# EAGLE design pc (EAGLE 9.6.2)
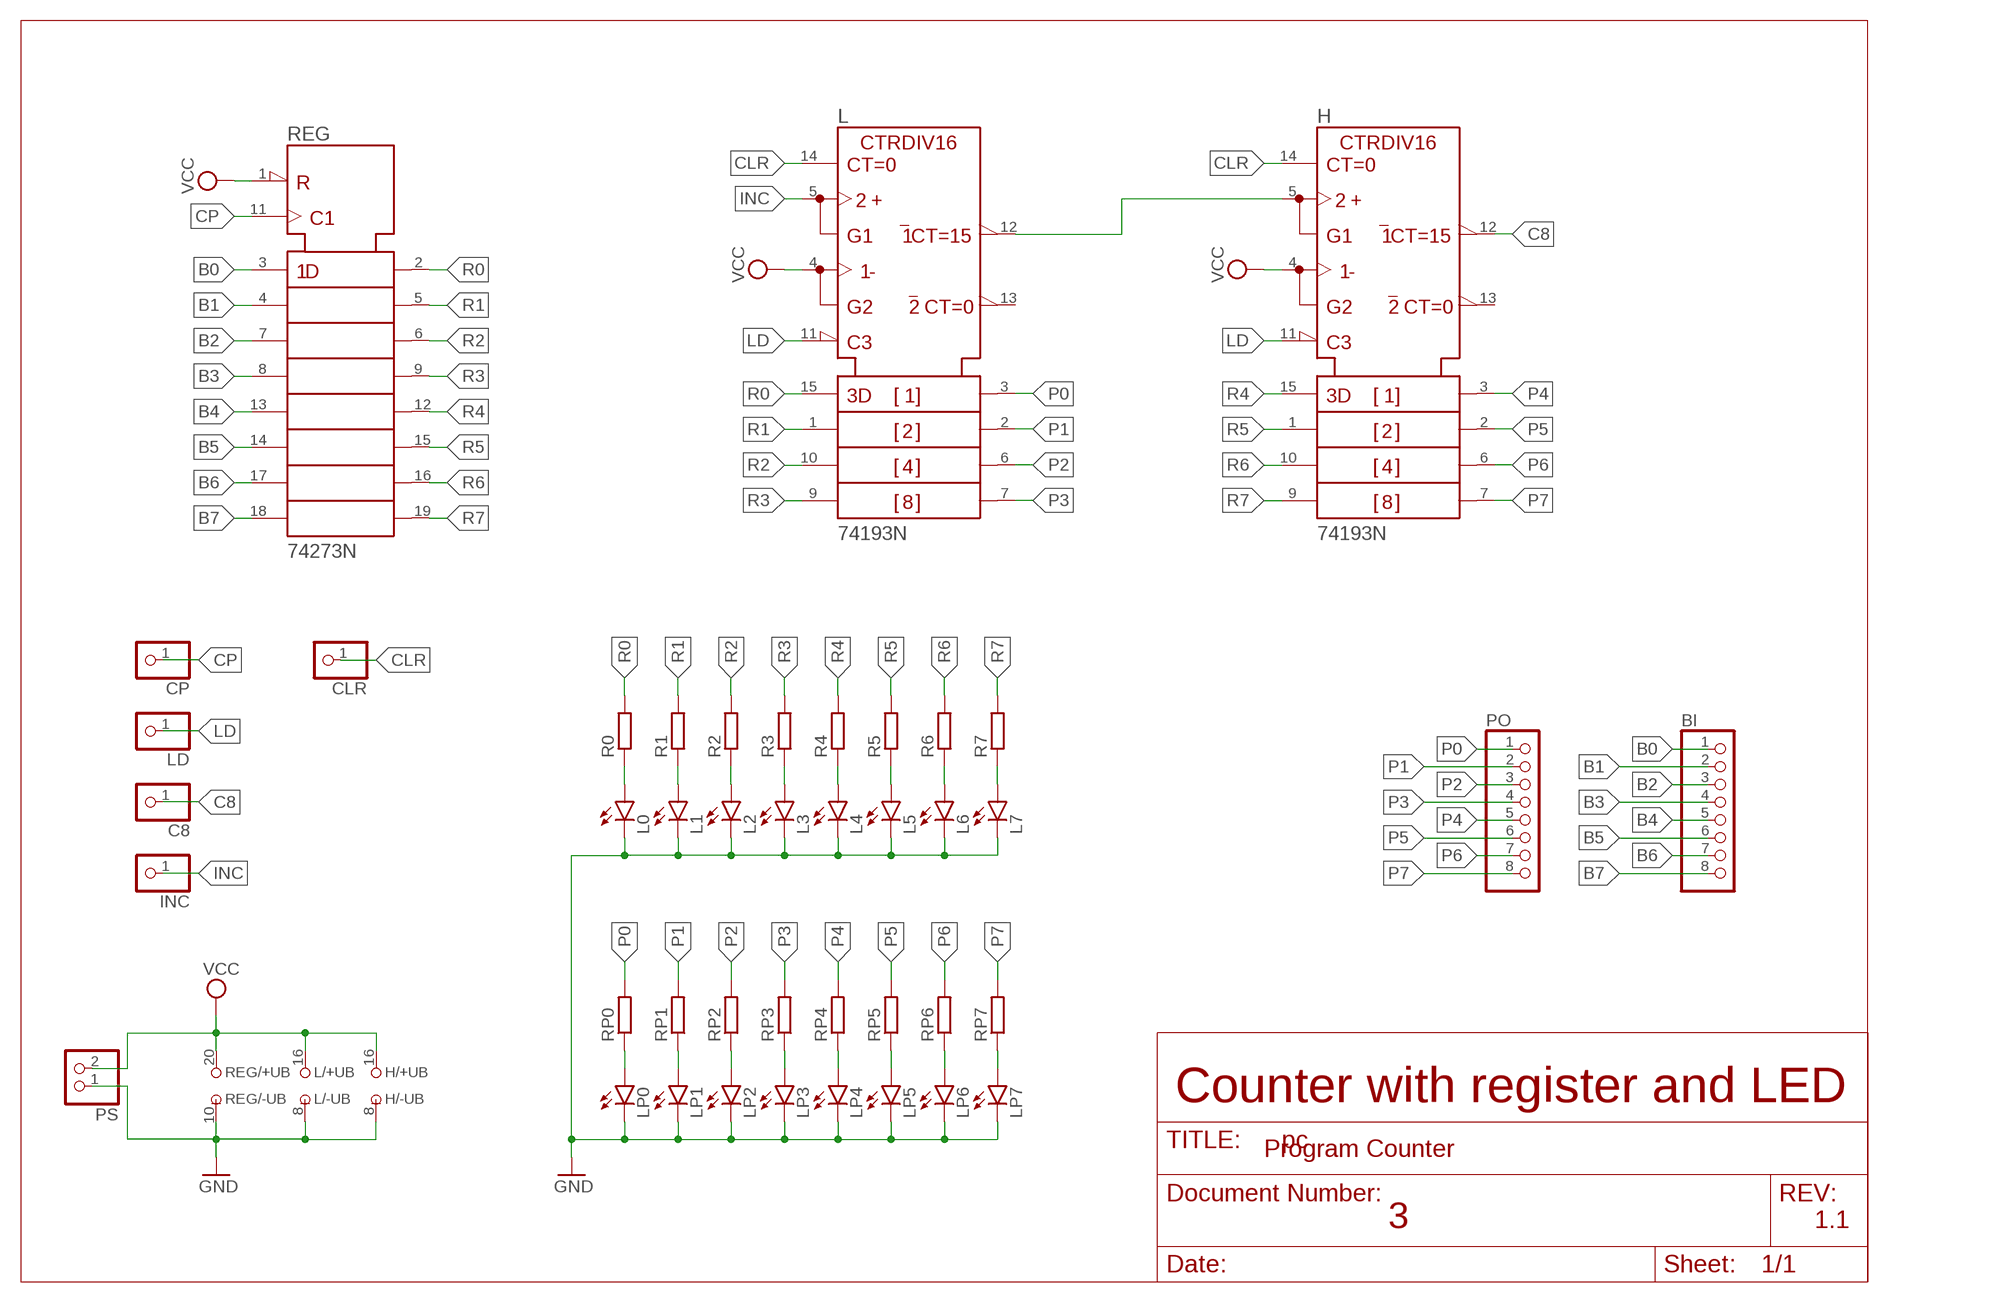
[diagram p0: schematic, sheet 1]

## Parts
BI  PINHD-1X8  [1X08]
C8  PINHD-1X1  [1X01]
CLR  PINHD-1X1  [1X01]
CP  PINHD-1X1  [1X01]
H  74193N  [DIL16]
INC  PINHD-1X1  [1X01]
L  74193N  [DIL16]
L0  LED5MM  [LED5MM]
L1  LED5MM  [LED5MM]
L2  LED5MM  [LED5MM]
L3  LED5MM  [LED5MM]
L4  LED5MM  [LED5MM]
L5  LED5MM  [LED5MM]
L6  LED5MM  [LED5MM]
L7  LED5MM  [LED5MM]
LD  PINHD-1X1  [1X01]
LP0  LED5MM  [LED5MM]
LP1  LED5MM  [LED5MM]
LP2  LED5MM  [LED5MM]
LP3  LED5MM  [LED5MM]
LP4  LED5MM  [LED5MM]
LP5  LED5MM  [LED5MM]
LP6  LED5MM  [LED5MM]
LP7  LED5MM  [LED5MM]
PO  PINHD-1X8  [1X08]
PS  PINHD-1X2  [1X02]
R0  R-EU_0204/7  [0204/7]
R1  R-EU_0204/7  [0204/7]
R2  R-EU_0204/7  [0204/7]
R3  R-EU_0204/7  [0204/7]
R4  R-EU_0204/7  [0204/7]
R5  R-EU_0204/7  [0204/7]
R6  R-EU_0204/7  [0204/7]
R7  R-EU_0204/7  [0204/7]
REG  74273N  [DIL20]
RP0  R-EU_0204/7  [0204/7]
RP1  R-EU_0204/7  [0204/7]
RP2  R-EU_0204/7  [0204/7]
RP3  R-EU_0204/7  [0204/7]
RP4  R-EU_0204/7  [0204/7]
RP5  R-EU_0204/7  [0204/7]
RP6  R-EU_0204/7  [0204/7]
RP7  R-EU_0204/7  [0204/7]

## Nets
B0: BI.1 REG.3(1D)
B1: BI.2 REG.4(2D)
B2: BI.3 REG.7(3D)
B3: BI.4 REG.8(4D)
B4: BI.5 REG.13(5D)
B5: BI.6 REG.14(6D)
B6: BI.7 REG.17(7D)
B7: BI.8 REG.18(8D)
C8: C8.1 H.12(!CO)
CLR: CLR.1 H.14(CLR) L.14(CLR)
CP: CP.1 REG.11(CLK)
GND: H.8(-UB) L0.K(C) L1.K(C) L2.K(C) L3.K(C) L4.K(C) L5.K(C) L6.K(C) L7.K(C) L.8(-UB) LP0.K(C) LP1.K(C) LP2.K(C) LP3.K(C) LP4.K(C) LP5.K(C) LP6.K(C) LP7.K(C) PS.1 REG.10(-UB)
INC: INC.1 L.5(UP)
LD: H.11(!LOAD) L.11(!LOAD) LD.1
N$17: L0.A R0.1
N$20: L1.A R1.1
N$21: H.5(UP) L.12(!CO)
N$24: L2.A R2.1
N$27: L3.A R3.1
N$45: LP0.A RP0.1
N$48: LP1.A RP1.1
N$51: LP2.A RP2.1
N$54: LP3.A RP3.1
N$57: LP4.A RP4.1
N$60: LP5.A RP5.1
N$63: LP6.A RP6.1
N$66: LP7.A RP7.1
N$70: L4.A R4.1
N$73: L5.A R5.1
N$76: L6.A R6.1
N$79: L7.A R7.1
P0: L.3(QA) PO.1 RP0.2
P1: L.2(QB) PO.2 RP1.2
P2: L.6(QC) PO.3 RP2.2
P3: L.7(QD) PO.4 RP3.2
P4: H.3(QA) PO.5 RP4.2
P5: H.2(QB) PO.6 RP5.2
P6: H.6(QC) PO.7 RP6.2
P7: H.7(QD) PO.8 RP7.2
R0: L.15(A) R0.2 REG.2(1Q)
R1: L.1(B) R1.2 REG.5(2Q)
R2: L.10(C) R2.2 REG.6(3Q)
R3: L.9(D) R3.2 REG.9(4Q)
R4: H.15(A) R4.2 REG.12(5Q)
R5: H.1(B) R5.2 REG.15(6Q)
R6: H.10(C) R6.2 REG.16(7Q)
R7: H.9(D) R7.2 REG.19(8Q)
VCC: H.4(DOWN) H.16(+UB) L.4(DOWN) L.16(+UB) PS.2 REG.1(!CLR) REG.20(+UB)
Unconnected: H.13(!BO) L.13(!BO)

## Notes on the sheet
- Counter with register and LED
- Program Counter
- 3 | 1.1

## Library data of the parts
BI PO = pinhead:PINHD-1X8: PIN HEADER
C8 CLR CP INC LD = pinhead:PINHD-1X1: PIN HEADER
H L = 74ttl-din:74*193: Synchronus 4-bit up down COUNTER
L0 L1-L7 LP0 LP1-LP7 = led:LED: LED OSRAM: - CHIPLED LG R971, LG N971, LY N971, LG Q971, LY Q971, LO R971, LY R971 LH N974, LH R974 LS Q976, LO Q976, LY Q976 LO Q996 - Hyper CHIPLED LW Q18S LB Q993, LB Q99A, LB R99A - SideLED LS A670, LO A670, LY A670, LG A670, LP A670 LB A673, LV A673, LT A673, LW A673 LH A674 LY A675 LS A676, LA A676, LO A676, LY A676, LW A676 LS A679, LY A679, LG A679 - Hyper Micro SIDELED® LS Y876, LA Y876, LO Y876, LY Y876 LT Y87S - SmartLED LW L88C, LW L88S LB L89C, LB L89S, LG L890 LS L89K, LO L89K, LY L89K LS L896, LA L896, LO L896, LY L896 - TOPLED LS T670, LO T670, LY T670, LG T670, LP T670 LSG T670, LSP T670, LSY T670, LOP T670, LYG T670 LG T671, LOG T671, LSG T671 LB T673, LV T673, LT T673, LW T673 LH T674 LS T676, LA T676, LO T676, LY T676, LB T676, LH T676, LSB T676, LW T676 LB T67C, LV T67C, LT T67C, LS T67K, LO T67K, LY T67K, LW E67C LS E67B, LA E67B, LO E67B, LY E67B, LB E67C, LV E67C, LT E67C LW T67C LS T679, LY T679, LG T679 LS T770, LO T770, LY T770, LG T770, LP T770 LB T773, LV T773, LT T773, LW T773 LH T774 LS E675, LA E675, LY E675, LS T675 LS T776, LA T776, LO T776, LY T776, LB T776 LHGB T686 LT T68C, LB T68C - Hyper Mini TOPLED® LB M676 - Mini TOPLED Santana® LG M470 LS M47K, LO M47K, LY M47K Source: http://www.osram.convergy.de LUXEON: - LUMILED® LXK2-PW12-R00, LXK2-PW12-S00, LXK2-PW14-U00, LXK2-PW14-V00 LXK2-PM12-R00, LXK2-PM12-S00, LXK2-PM14-U00 LXK2-PE12-Q00, LXK2-PE12-R00, LXK2-PE12-S00, LXK2-PE14-T00, LXK2-PE14-U00 LXK2-PB12-K00, LXK2-PB12-L00, LXK2-PB12-M00, LXK2-PB14-N00, LXK2-PB14-P00, LXK2-PB14-Q00 LXK2-PR12-L00, LXK2-PR12-M00, LXK2-PR14-Q00, LXK2-PR14-R00 LXK2-PD12-Q00, LXK2-PD12-R00, LXK2-PD12-S00 LXK2-PH12-R00, LXK2-PH12-S00 LXK2-PL12-P00, LXK2-PL12-Q00, LXK2-PL12-R00 Source: www.luxeon.com KINGBRIGHT: KA-3528ASYC Source: www.kingbright.com
PS = pinhead:PINHD-1X2: PIN HEADER
R0 R1-R7 RP0 RP1-RP7 = rcl:R-EU_: RESISTOR, European symbol; SPICEPREFIX: R
REG = 74ttl-din:74*273: Octal D type FLIP FLOP, clear

## Board
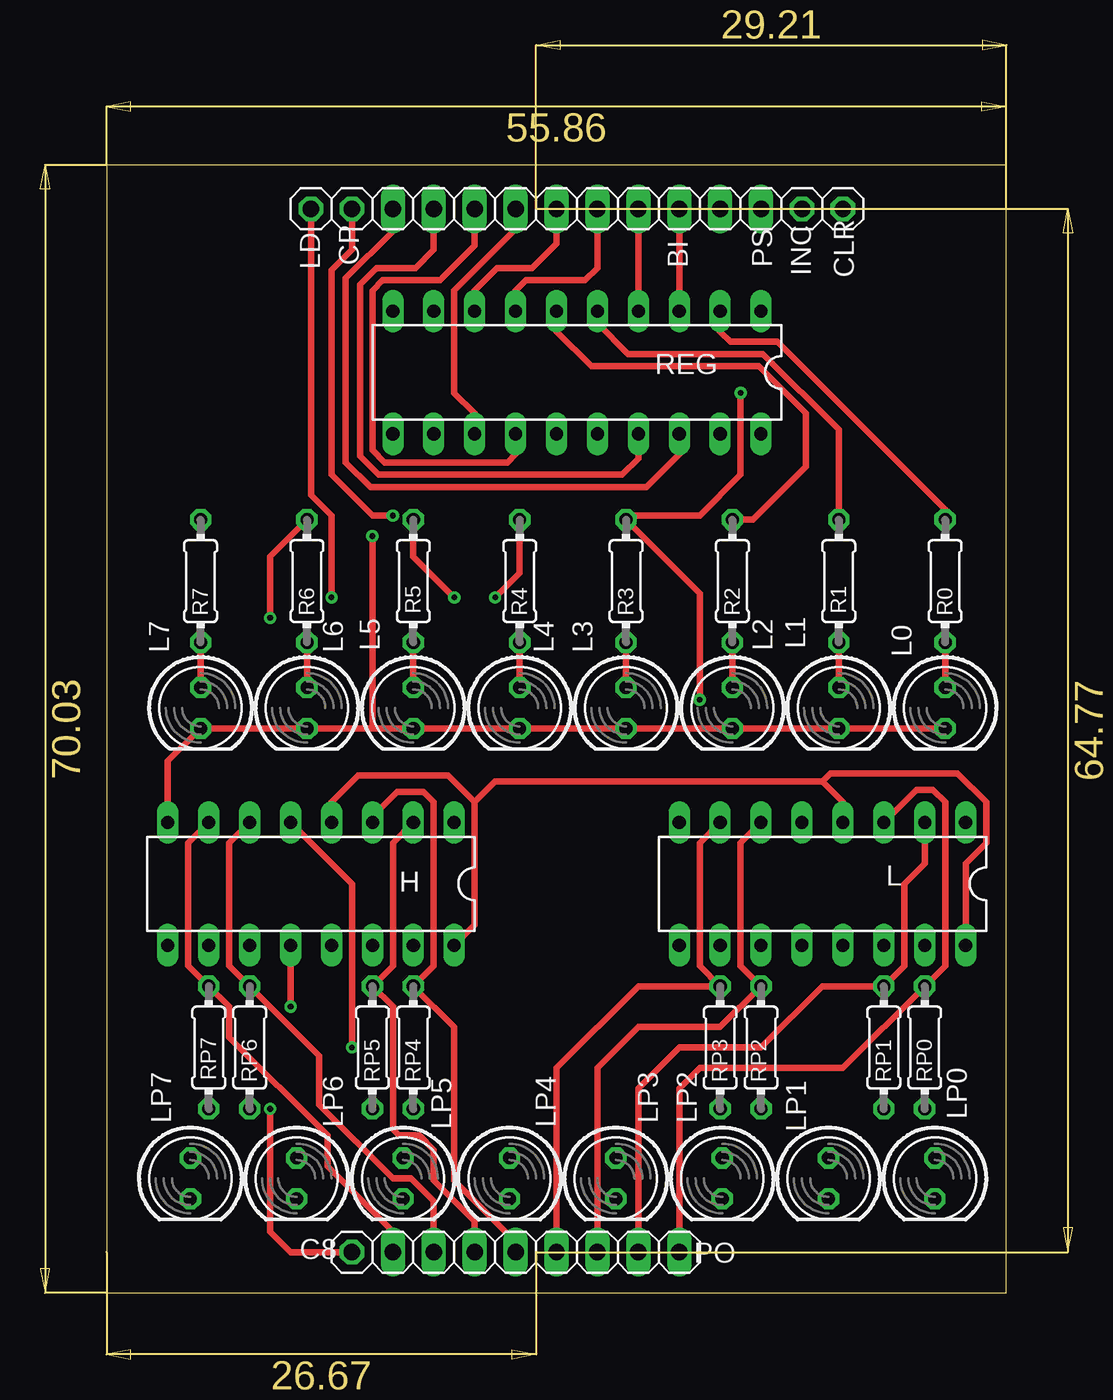
[diagram p1: board, top side]
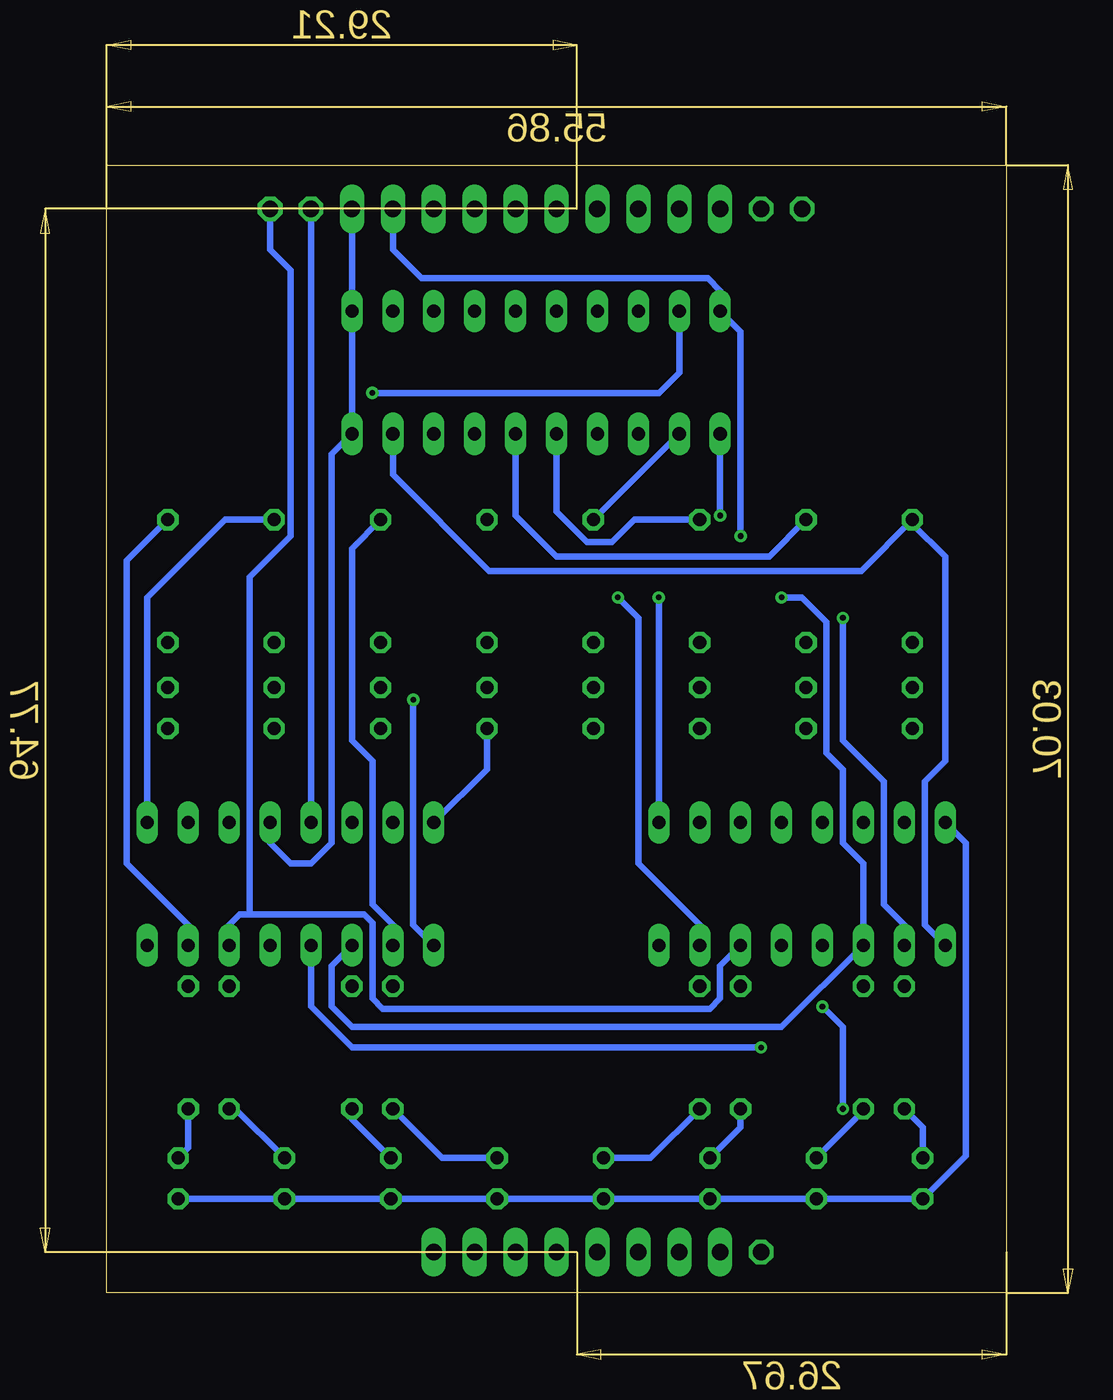
[diagram p2: board, bottom side, seen from below]

Size 55.86 x 70.03 mm. Coordinates in mm from the lower left corner, seen from the top.
Outline: 0,0 55.86,0 55.86,70.03 0,70.03 0,0
Copper layers (1*16): Top 0.035mm / dielectric 1.5mm / Bottom 0.035mm
Design rules "default": minimum track width 6mil, minimum drill 0.35mm, track to track 6mil, track to pad 6mil, pad to pad 6mil, via to via 6mil, smd to smd 6mil, copper to edge 40mil, drill to drill 6mil, minimum pad ring 10mil, minimum via ring 8mil, stop-mask expansion 4mil, vias tented up to drill 0mil, thermal gap 10mil

### Footprints (pad centres in the part's own frame; a part is rotated, then mirrored left to right if it is on the bottom)
1X08 = drill 1.016 long: 1 -8.89,0; 2 -6.35,0; 3 -3.81,0; 4 -1.27,0; 5 1.27,0; 6 3.81,0; 7 6.35,0; 8 8.89,0
1X01 = drill 1.016 octagon: 1 0,0
DIL16 = drill 0.813 long: 1 -8.89,-3.81; 2 -6.35,-3.81; 3 -3.81,-3.81; 4 -1.27,-3.81; 5 1.27,-3.81; 6 3.81,-3.81; 7 6.35,-3.81; 8 8.89,-3.81; 9 8.89,3.81; 10 6.35,3.81; 11 3.81,3.81; 12 1.27,3.81; 13 -1.27,3.81; 14 -3.81,3.81; 15 -6.35,3.81; 16 -8.89,3.81
LED5MM = drill 0.813 octagon: A -1.27,0; K 1.27,0
1X02 = drill 1.016 long: 1 -1.27,0; 2 1.27,0
0204/7 = drill 0.813 octagon: 1 -3.81,0; 2 3.81,0
DIL20 = drill 0.813 long: 1 -11.43,-3.81; 2 -8.89,-3.81; 3 -6.35,-3.81; 4 -3.81,-3.81; 5 -1.27,-3.81; 6 1.27,-3.81; 7 3.81,-3.81; 8 6.35,-3.81; 9 8.89,-3.81; 10 11.43,-3.81; 11 11.43,3.81; 12 8.89,3.81; 13 6.35,3.81; 14 3.81,3.81; 15 1.27,3.81; 16 -1.27,3.81; 17 -3.81,3.81; 18 -6.35,3.81; 19 -8.89,3.81; 20 -11.43,3.81

### Placement (x,y rotation side)
BI  26.67,67.31 180 top
C8  15.24,2.54 0 top
CLR  45.72,67.31 0 top
CP  15.24,67.31 0 top
H  12.7,25.4 180 top
INC  43.18,67.31 0 top
L  44.45,25.4 180 top
L0  52.07,36.32 270 top
L1  45.47,36.32 270 top
L2  38.86,36.32 270 top
L3  32.26,36.32 270 top
L4  25.65,36.32 270 top
L5  19.05,36.32 270 top
L6  12.45,36.32 270 top
L7  5.84,36.32 270 top
LD  12.7,67.31 0 top
LP0  51.44,7.11 270 top
LP1  44.83,7.11 270 top
LP2  38.23,7.11 270 top
LP3  31.62,7.11 270 top
LP4  25.02,7.11 270 top
LP5  18.41,7.11 270 top
LP6  11.81,7.11 270 top
LP7  5.21,7.11 270 top
PO  26.67,2.54 180 top
PS  39.37,67.31 0 top
R0  52.07,44.2 90 top
R1  45.47,44.2 90 top
R2  38.86,44.2 90 top
R3  32.26,44.2 90 top
R4  25.65,44.2 90 top
R5  19.05,44.2 90 top
R6  12.45,44.2 90 top
R7  5.84,44.2 90 top
REG  29.21,57.15 180 top
RP0  50.8,15.24 90 top
RP1  48.26,15.24 90 top
RP2  40.64,15.24 90 top
RP3  38.1,15.24 90 top
RP4  19.05,15.24 90 top
RP5  16.51,15.24 90 top
RP6  8.89,15.24 90 top
RP7  6.35,15.24 90 top

### Tracks (layer width: path | path; a pad name or v marks a point on that pad's centre or on a via)
B0
  Top 0.4: BI.1 REG.3
B1
  Top 0.4: REG.4 BI.2
B2
  Top 0.4: REG.7 25.4,62.23 26.04,62.87 29.72,62.87 30.48,63.63 BI.3
B3
  Top 0.4: REG.8 22.86,62.23 24.26,63.63 26.42,63.63 27.94,65.15 BI.4
B4
  Top 0.4: BI.5 25.4,66.04 21.59,62.23 21.59,55.88 22.86,54.61 REG.13
B5
  Top 0.4: REG.14 25.4,52.07 24.89,51.56 17.27,51.56 16.51,52.32 16.51,62.23 17.14,62.87 20.7,62.87 22.86,65.02 BI.6
B6
  Top 0.4: REG.17 33.02,51.82 32,50.8 16.89,50.8 15.75,51.94 15.75,62.61 16.76,63.63 19.18,63.63 20.32,64.77 BI.7
B7
  Top 0.4: REG.18 35.56,52.07 33.53,50.04 16.38,50.04 14.86,51.56 14.86,62.99 17.78,65.91 BI.8
C8  (via drill 0.35)
  Top 0.4: C8.1 11.43,2.54 10.16,3.81 v10.16,11.43 | v11.43,17.78 H.12
  Bottom 0.4: v10.16,11.43 10.16,16.51 v11.43,17.78
CLR
  Bottom 0.4: H.14 17.78,20.32 17.78,18.29 18.41,17.65 38.73,17.65 39.37,18.29 39.37,22.99 39.88,23.5 46.99,23.5 | L.14 48.26,22.86 47.62,23.5 46.99,23.5 | CLR.1 45.72,64.77 44.45,63.5 44.45,46.99 46.99,44.45 46.99,23.5
CP  (via drill 0.35)
  Top 0.4: CP.1 15.24,64.77 13.97,63.5 13.97,50.8 16.51,48.26 v17.78,48.26
  Bottom 0.4: v17.78,48.26 REG.11
GND  (via drill 0.35)
  Top 0.4: L0.K L1.K L2.K L3.K L4.K L5.K 16.51,35.05 | 16.51,35.05 L6.K L7.K 3.81,33.02 H.8 | v16.51,46.99 16.51,35.05
  Bottom 0.4: PS.1 38.1,64.77 36.32,62.99 18.54,62.99 17.78,62.23 REG.10 16.51,59.69 v16.51,46.99 | LP0.K LP1.K LP2.K LP3.K LP4.K LP5.K LP6.K LP7.K 2.54,8.51 2.54,27.94 H.8 | L.8 32.26,32.51 L3.K
INC
  Bottom 0.4: L.5 INC.1
LD  (via drill 0.35)
  Top 0.4: v13.97,43.18 13.97,48.26 12.7,49.53 LD.1
  Bottom 0.4: v13.97,43.18 12.7,43.18 11.18,41.66 11.18,33.53 10.16,32.51 10.16,27.94 8.89,26.67 H.11 13.97,16.51 40.64,16.51 41.91,17.78 41.91,20.32 L.11
N$17
  Top 0.4: R0.1 L0.A
N$20
  Top 0.4: R1.1 L1.A
N$21  (via drill 0.35)
  Top 0.4: v15.24,15.24 15.24,25.4 H.5
  Bottom 0.4: L.12 43.18,17.78 40.64,15.24 v15.24,15.24
N$24
  Top 0.4: L2.A R2.1
N$27
  Top 0.4: R3.1 L3.A
N$45
  Bottom 0.4: LP0.A 50.8,9.02 RP0.1
N$48
  Bottom 0.4: LP1.A 47.88,11.43 RP1.1
N$51
  Bottom 0.4: LP2.A 40.64,10.79 RP2.1
N$54
  Bottom 0.4: LP3.A 35.05,8.38 RP3.1
N$57
  Bottom 0.4: RP4.1 22.1,8.38 LP4.A
N$60
  Bottom 0.4: RP5.1 16.51,10.29 LP5.A
N$63
  Bottom 0.4: RP6.1 8.89,11.3 LP6.A
N$66
  Bottom 0.4: LP7.A 5.21,10.29 RP7.1
N$70
  Top 0.4: R4.1 L4.A
N$73
  Top 0.4: L5.A R5.1
N$76
  Top 0.4: R6.1 L6.A
N$79
  Top 0.4: L7.A R7.1
P0
  Top 0.4: L.3 50.29,31.24 51.31,31.24 52.07,30.48 52.07,20.32 RP0.2 45.72,13.97 36.83,13.97 35.56,12.7 PO.1
P1
  Top 0.4: L.2 50.8,26.67 49.53,25.4 49.53,20.32 RP1.2 44.45,19.05 40.64,15.24 35.56,15.24 33.02,12.7 PO.2
P2
  Top 0.4: L.6 39.37,27.94 39.37,20.32 RP2.2 38.1,16.51 33.02,16.51 30.48,13.97 PO.3
P3
  Top 0.4: L.7 36.83,27.94 36.83,20.32 RP3.2 33.02,19.05 27.94,13.97 PO.4
P4
  Top 0.4: H.3 16.51,29.59 18.03,31.11 19.68,31.11 20.32,30.48 20.32,20.32 RP4.2 21.59,16.51 21.59,6.99 25.4,3.17 PO.5
P5
  Top 0.4: H.2 17.78,27.94 17.78,20.32 RP5.2 17.78,17.78 17.78,10.16 18.16,9.78 19.43,9.78 20.32,8.89 20.32,6.99 22.86,4.45 PO.6
P6
  Top 0.4: H.6 7.62,27.94 7.62,20.32 RP6.2 13.21,14.73 13.21,11.68 17.78,7.11 18.92,7.11 20.32,5.71 PO.7
P7
  Top 0.4: H.7 5.08,27.94 5.08,20.32 RP7.2 7.62,17.78 7.62,15.88 13.72,9.78 13.72,7.87 17.78,3.81 PO.8
R0
  Top 0.4: REG.2 38.1,59.69 38.73,59.05 41.66,59.05 52.07,48.64 R0.2
  Bottom 0.4: R0.2 54.61,45.47 54.61,26.67 50.8,22.86 L.15
R1
  Top 0.4: R1.2 45.47,53.59 40.77,58.29 32.38,58.29 30.48,60.2 REG.5
  Bottom 0.4: R1.2 48.51,48.01 53.34,43.18 L.1
R2
  Top 0.4: REG.6 27.94,59.69 30.1,57.53 40.51,57.53 43.43,54.61 43.43,51.31 40.13,48.01 R2.2
  Bottom 0.4: R2.2 40.64,46.23 40.64,34.29 39.37,33.02 39.37,24.13 38.1,22.86 L.10
R3  (via drill 0.35)
  Top 0.4: v39.37,55.88 39.37,50.8 36.83,48.26 32.51,48.26 R3.2 36.83,43.43 v36.83,36.83
  Bottom 0.4: REG.9 20.32,57.15 21.59,55.88 v39.37,55.88 | v36.83,36.83 36.83,22.86 L.9
R4  (via drill 0.35)
  Top 0.4: v24.13,43.18 25.65,44.7 R4.2
  Bottom 0.4: R4.2 REG.12 | H.15 19.05,22.86 22.86,26.67 22.86,41.91 v24.13,43.18
R5  (via drill 0.35)
  Top 0.4: v21.59,43.18 19.05,45.72 R5.2
  Bottom 0.4: R5.2 23.11,48.01 24.51,46.61 26.04,46.61 27.94,48.51 REG.15 | H.1 v21.59,43.18
R6  (via drill 0.35)
  Top 0.4: v10.16,41.91 10.16,45.72 R6.2
  Bottom 0.4: R6.2 14.73,45.72 27.94,45.72 30.48,48.26 REG.16 | H.10 6.35,22.86 7.62,24.13 7.62,31.75 10.16,34.29 v10.16,41.91
R7
  Bottom 0.4: REG.19 38.1,50.8 32.13,44.83 9.02,44.83 R7.2 5.84,47.75 3.81,45.72 3.81,33.02 5.08,31.75 5.08,22.86 H.9
VCC
  Top 0.4: H.4 13.97,30.48 15.62,32.13 21.21,32.13 22.86,30.48 | 22.86,30.48 22.86,22.86 H.16 | 22.86,30.48 24.13,31.75 44.45,31.75 | 44.45,31.75 45.72,30.48 L.4 | L.16 53.34,26.67 54.61,27.94 54.61,30.48 52.83,32.26 44.96,32.26 44.45,31.75
  Bottom 0.4: PS.2 REG.1 REG.20 41.91,52.07 41.91,27.94 43.18,26.67 44.45,26.67 45.72,27.94 L.4